# EAGLE design Zio Qwiic Adapter (EAGLE 8.4.1)
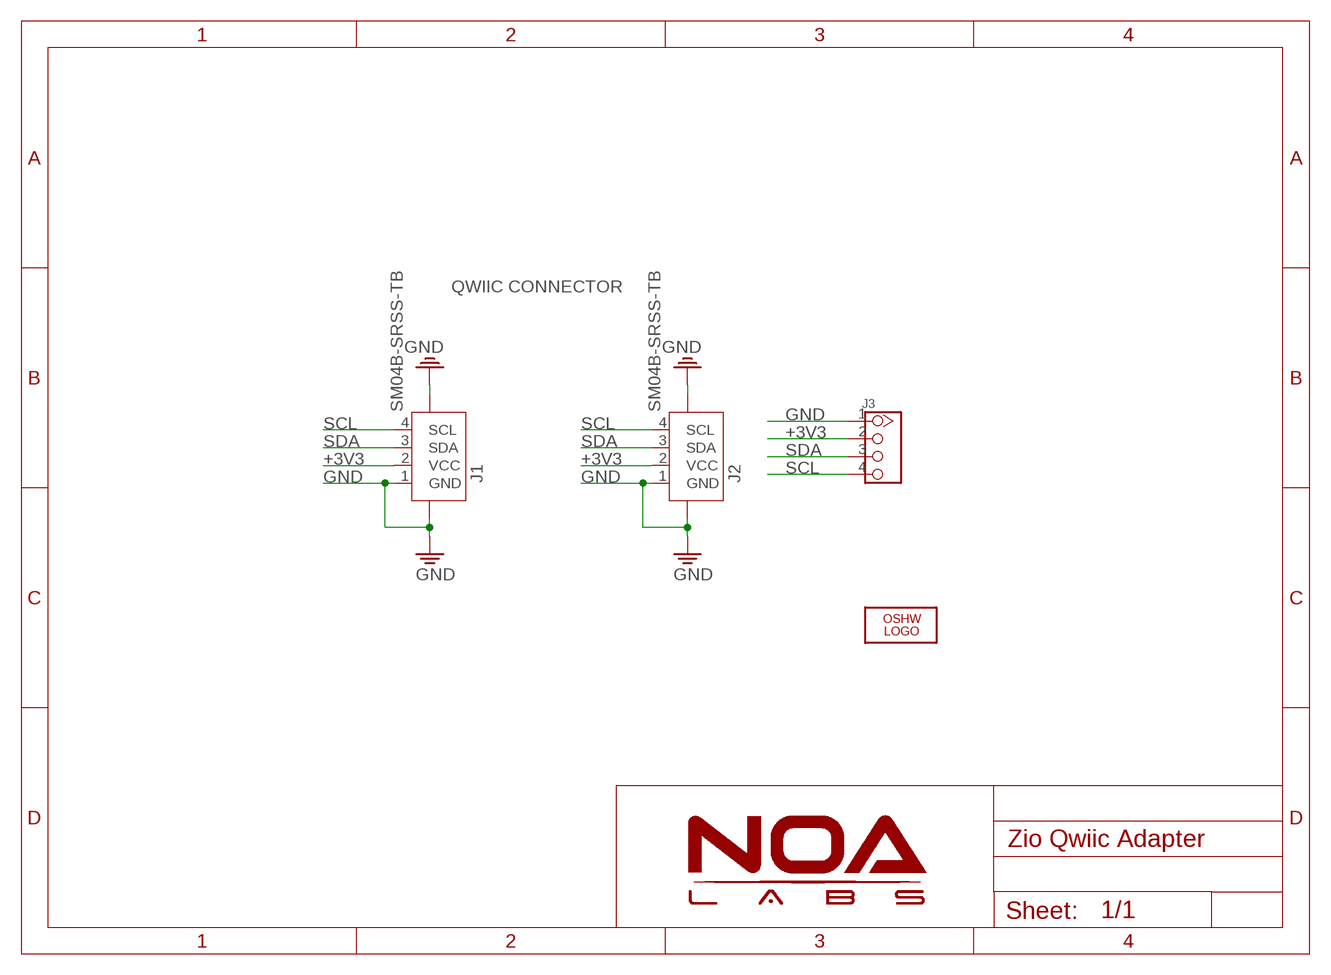
[diagram p0: schematic, sheet 1]

## Parts
J1  SM04B-SRSS-TB  JST-SH-4P-1.0  [JST-SH-4P]
J2  SM04B-SRSS-TB  JST-SH-4P-1.0  [JST-SH-4P]
J3  HEADER-4P-80/40MIL  [4P-2.54-80/40MIL]
LOGO1  LOGO-OSHW-6MILX0070-NT  [OSHW_6X70_NOTEXT]

## Nets
+3V3: J1.2(VCC) J2.2(VCC) J3.2
GND: J1.1(GND) J1.NC1 J1.NC2 J2.1(GND) J2.NC1 J2.NC2 J3.1
SCL: J1.4(SCL) J2.4(SCL) J3.4
SDA: J1.3(SDA) J2.3(SDA) J3.3

## Notes on the sheet
- QWIIC CONNECTOR

## Library data of the parts
J1 J2 = Connector:JST-SH-4P
J3 = Connector:HEADER-4P
LOGO1 = Logo:LOGO-OSHW-6MIL

## Board
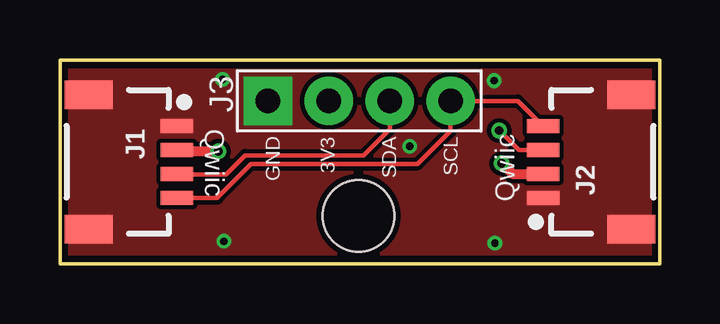
[diagram p1: board, top side]
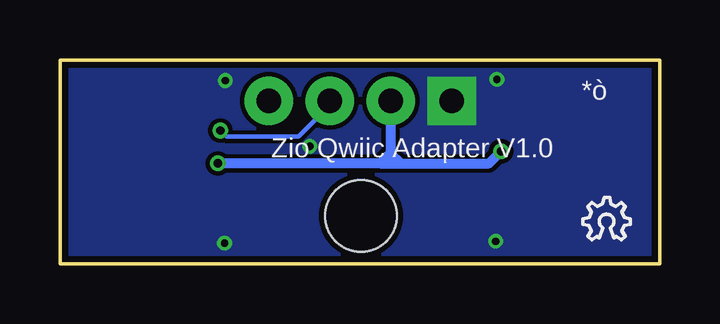
[diagram p2: board, bottom side, seen from below]

Size 25 x 8.51 mm. Coordinates in mm from the lower left corner, seen from the top.
Outline: 0,0 0,8.51 25,8.51 25,0 0,0
Copper layers (1*16): Top 0.035mm / dielectric 1.5mm / Bottom 0.035mm
Design rules "NOA Eagle Rule *": minimum track width 7mil, minimum drill 12mil, track to track 7mil, track to pad 7mil, pad to pad 7mil, via to via 7mil, smd to smd 0mil, copper to edge 10mil, drill to drill 10mil, minimum pad ring 10mil, minimum via ring 6mil, stop-mask expansion 2mil, vias tented up to drill 25mil, thermal gap 10mil
Holes 3 mm at 12.45,2

### Footprints (pad centres in the part's own frame; a part is rotated, then mirrored left to right if it is on the bottom)
JST-SH-4P = smd 0.6 x 1.35: 1 1.5,0; 2 0.5,0; 3 -0.5,0; 4 -1.5,0 | smd 1.2 x 2: NC1 -2.8,3.675; NC2 2.8,3.675
4P-2.54-80/40MIL = drill 1.016 pad 2.032 square: 1 0,3.81 | drill 1.016 pad 2.032: 2 0,1.27; 3 0,-1.27; 4 0,-3.81

### Placement (x,y rotation side)
E$3  [6MM]  19.41,4.34 0 bottom
J1  4.88,4.25 90 top
J2  20.14,4.25 270 top
J3  12.48,6.8 90 top
LOGO1  3.2,0.99 0 bottom

### Tracks (layer width: path | path; a pad name or v marks a point on that pad's centre or on a via)
+3V3  (via drill 0.35)
  Top 0.178: J1.2 4.93,4.7 5.19,4.7
  Top 0.406: 5.19,4.7 v6.6,4.7 | v18.41,4.19 18.86,3.75 J2.2
  Bottom 0.406: 11.65,4.19 11.32,4.19 | 11.65,4.19 v18.41,4.19 | 11.32,4.19 10.81,4.19 | J3.2 11.21,4.63 | 11.21,4.59 11.21,4.3 11.32,4.19 | 11.21,4.63 11.21,4.59 | 11.21,4.59 10.81,4.19 | 11.21,4.63 11.65,4.19 | v6.6,4.7 7.11,4.19 10.81,4.19
GND  (via drill 0.3)
  other vias: 14.58,4.9 18.11,7.65 6.78,7.7 6.83,0.94 18.14,0.86
  pour Top (no thermals): 0,8.51 0,0 24.99,0 24.99,8.51
  pour Bottom (no thermals): 0,8.51 0,0 24.99,0 24.99,8.51
SCL
  Top 0.178: J2.4 19.09,6.8 J3.4 16.29,5.55 14.91,4.17 7.98,4.17 6.55,2.74 J1.4
SDA  (via drill 0.35)
  Top 0.178: J3.3 13.75,5.62 12.65,4.52 7.72,4.52 6.93,3.73 4.89,3.73 J1.3 | v18.31,5.56 19.13,4.75 J2.3
  Bottom 0.178: v18.31,5.56 18.06,5.31 15.06,5.31 13.75,6.62 J3.3

### Text on the board
tPlace: Qwiic | GND | 3V3 | SDA | SCL | Qwiic
bPlace: *ò | Zio Qwiic Adapter V1.0